# Altium project press.PrjPcb
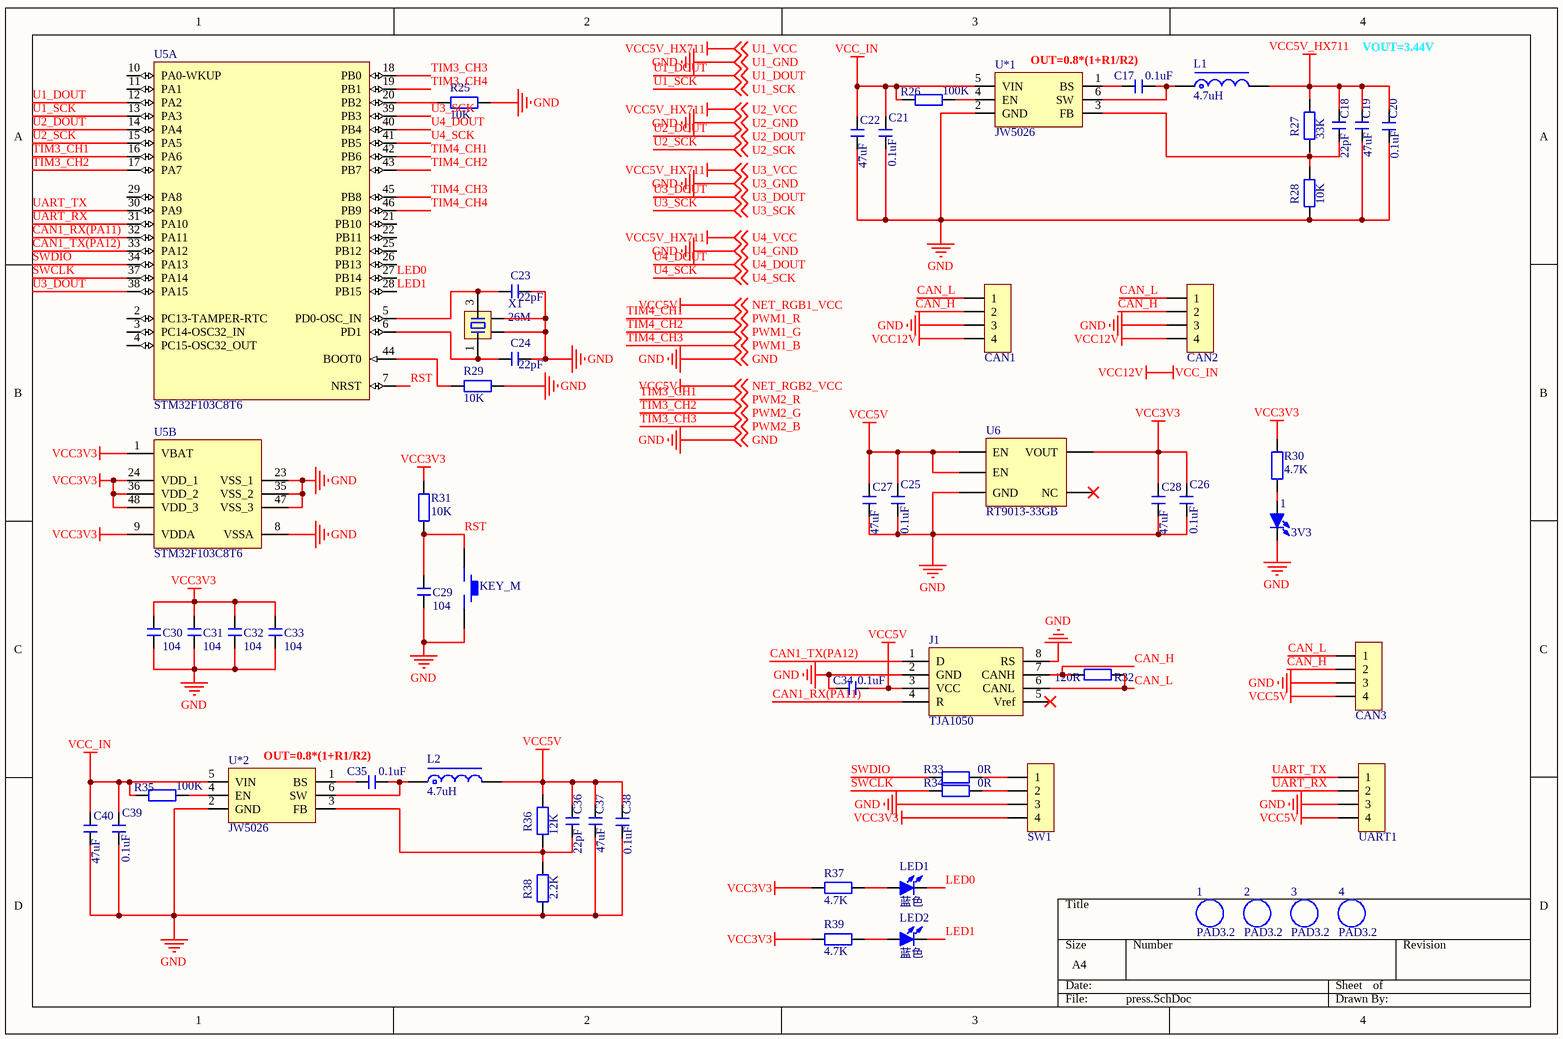
[diagram p0: press.SchDoc]
3 sheets, 178 parts. Net scope: global (net labels, ports and power ports of the same name join across sheets).
Board file: press.PcbDoc
Sheets:
  press.SchDoc
  RGB_LED.SchDoc
  HX711.SchDoc

## Sheet press.SchDoc
size A4

### Parts
(Parts that share a designator on the sheet are numbered #1, #2 ... from top to bottom, then left to right.)
1#1  3V3  [LED 0805R]
1#2  PAD3.2  [PAD3.2]
2  PAD3.2  [PAD3.2]
3  PAD3.2  [PAD3.2]
4  PAD3.2  [PAD3.2]
C17  0.1uF  [C 0603_L]
C18  22pF  [C 0603_L]
C19  47uF  [C 0805_L]
C20  0.1uF  [C 0805_L]
C21  0.1uF  [C 0805_L]
C22  47uF  [C 0805_L]
C23  22pF  [C 0603_L]
C24  22pF  [C 0603_L]
C25  0.1uF  [C 0805_L]
C26  0.1uF  [C 0805_L]
C27  47uF  [C 0805_L]
C28  47uF  [C 0805_L]
C29  104  [C 0603_L]
C30  104  [C 0603_L]
C31  104  [C 0603_L]
C32  104  [C 0603_L]
C33  104  [C 0603_L]
C34  0.1uF  [C 0603_L]
C35  0.1uF  [C 0603_L]
C36  22pF  [C 0603_L]
C37  47uF  [C 0805_L]
C38  0.1uF  [C 0805_L]
C39  0.1uF  [C 0805_L]
C40  47uF  [C 0805_L]
CAN1  HDR-1X4  [MX 1.25-WS-4P]  (value not drawn)
CAN2  HDR-1X4  [MX 1.25-WS-4P]  (value not drawn)
CAN3  HDR-1X4  [MX 1.25-WS-4P]  (value not drawn)
J1  TJA1050  [SOIC-8_150mil]
L1  4.7uH  [CD53]
L2  4.7uH  [CD53]
LED1  蓝色  [LED 0805B]
LED2  蓝色  [LED 0805B]
R25  10K  [R 0603_L]
R26  100K  [R 0603_L]
R27  33K  [R 0603_L]
R28  10K  [R 0603_L]
R29  10K  [R 0603_L]
R30  4.7K  [R 0603_L]
R31  10K  [R 0603_L]
R32  120R  [R 0603_L]
R33  0R  [R 0603_L]
R34  0R  [R 0603_L]
R35  100K  [R 0603_L]
R36  12K  [R 0603_L]
R37  4.7K  [R 0603_L]
R38  2.2K  [R 0603_L]
R39  4.7K  [R 0603_L]
RST1  KEY_M  [SMD-3.2*4.2]
SW1  HDR-1X4  [MX 1.25-WS-4P]  (value not drawn)
U5  STM32F103C8T6  [LQFP48_N]  (parts A,B of 2)
U6  RT9013-33GB  [SOT23-5M]
U*1  JW5026  [SOT-23-6_L2.9-W1.6-P0.95-LS2.8-BL]
U*2  JW5026  [SOT-23-6_L2.9-W1.6-P0.95-LS2.8-BL]
UART1  HDR-1X4  [MX 1.25-WS-4P]  (value not drawn)
X1  26M  [OSC 3225-4P]

### Nets
GND: 1#1.2(K) C19.1 C20.1 C21.1 C22.1 C23.2 C24.2 C25.1 C26.1 C27.1 C28.1 C29.1 C30.1 C31.1 C32.1 C33.1 C34.2 C37.1 C38.1 C39.1 C40.1 CAN1.3 CAN2.3 CAN3.3 J1.2(GND) J1.8(RS) R25.2 R28.1 R29.2 R38.1 RST1.2 SW1.3 U5.8(VSSA) U5.23(VSS_1) U5.35(VSS_2) U5.47(VSS_3) U6.2(GND) U*1.2(GND) U*2.2(GND) UART1.3 X1.2 X1.4 ; off-sheet U1_GND, off-sheet U2_GND, off-sheet U3_GND, off-sheet U4_GND, off-sheet GND  [also labelled U1_GND, U2_GND, U3_GND, U4_GND]
NET_RGB1_VCC: C25.2 C27.2 C34.1 C36.2 C37.2 C38.2 CAN3.4 J1.3(VCC) L2.2 R36.2 U6.1(EN) U6.3(EN) UART1.4 ; off-sheet NET_RGB1_VCC, off-sheet NET_RGB2_VCC  [also labelled NET_RGB2_VCC, VCC5V]
U1_VCC: C18.2 C19.2 C20.2 L1.2 R27.2 ; off-sheet U1_VCC, off-sheet U2_VCC, off-sheet U3_VCC, off-sheet U4_VCC  [also labelled U2_VCC, U3_VCC, U4_VCC, VCC5V_HX711]
VCC3V3: C26.2 C28.2 C30.2 C31.2 C32.2 C33.2 R30.1 R31.2 R37.1 R39.1 SW1.4 U5.1(VBAT) U5.9(VDDA) U5.24(VDD_1) U5.36(VDD_2) U5.48(VDD_3) U6.5(VOUT)
VCC12V: C21.2 C22.2 C39.2 C40.2 CAN1.4 CAN2.4 R26.2 R35.2 U*1.5(VIN) U*2.5(VIN)  [also labelled VCC_IN]
CAN1_RX(PA11): J1.4(R) U5.32(PA11)
CAN1_TX(PA12): J1.1(D) U5.33(PA12)
CAN_H: CAN1.2 CAN2.2 CAN3.2 J1.7(CANH) R32.1
CAN_L: CAN1.1 CAN2.1 CAN3.1 J1.6(CANL) R32.2
LED0: LED1.2(K) U5.27(PB14)
LED1: LED2.2(K) U5.28(PB15)
PWM1_B: U5.45(PB8) ; off-sheet PWM1_B  [also labelled TIM4_CH3]
PWM1_G: U5.43(PB7) ; off-sheet PWM1_G  [also labelled TIM4_CH2]
PWM1_R: U5.42(PB6) ; off-sheet PWM1_R  [also labelled TIM4_CH1]
PWM2_B: U5.18(PB0) ; off-sheet PWM2_B  [also labelled TIM3_CH3]
PWM2_G: U5.17(PA7) ; off-sheet PWM2_G  [also labelled TIM3_CH2]
PWM2_R: U5.16(PA6) ; off-sheet PWM2_R  [also labelled TIM3_CH1]
RST: C29.2 R31.1 RST1.1 U5.7(NRST)
SWCLK: R34.1 U5.37(PA14)
SWDIO: R33.1 U5.34(PA13)
TIM3_CH4: U5.19(PB1)
TIM4_CH4: U5.46(PB9)
U1_DOUT: U5.12(PA2) ; off-sheet U1_DOUT
U1_SCK: U5.13(PA3) ; off-sheet U1_SCK
U2_DOUT: U5.14(PA4) ; off-sheet U2_DOUT
U2_SCK: U5.15(PA5) ; off-sheet U2_SCK
U3_DOUT: U5.38(PA15) ; off-sheet U3_DOUT
U3_SCK: U5.39(PB3) ; off-sheet U3_SCK
U4_DOUT: U5.40(PB4) ; off-sheet U4_DOUT
U4_SCK: U5.41(PB5) ; off-sheet U4_SCK
UART_RX: U5.31(PA10) UART1.2
UART_TX: U5.30(PA9) UART1.1
Net1#1_1: 1#1.1(A) R30.2
NetC17_1: C17.1 U*1.1(BS)
NetC17_2: C17.2 L1.1 U*1.6(SW)
NetC18_1: C18.1 R27.1 R28.2 U*1.3(FB)
NetC23_1: C23.1 U5.5(PD0-OSC_IN) X1.3
NetC24_1: C24.1 U5.6(PD1) X1.1
NetC35_1: C35.1 U*2.1(BS)
NetC35_2: C35.2 L2.1 U*2.6(SW)
NetC36_1: C36.1 R36.1 R38.2 U*2.3(FB)
NetLED1_1: LED1.1(A) R37.2
NetLED2_1: LED2.1(A) R39.2
NetR25_1: R25.1 U5.20(PB2)
NetR26_1: R26.1 U*1.4(EN)
NetR29_1: R29.1 U5.44(BOOT0)
NetR33_2: R33.2 SW1.1
NetR34_2: R34.2 SW1.2
NetR35_1: R35.1 U*2.4(EN)

Not connected (* = marked no-connect by the designer): J1 5(Vref)*; U5 2(PC13-TAMPER-RTC) 3(PC14-OSC32_IN) 4(PC15-OSC32_OUT) 10(PA0-WKUP) 11(PA1) 21(PB10) 22(PB11) 25(PB12) 26(PB13) 29(PA8); U6 4(NC)*

### Notes on the sheet
- OUT=0.8*(1+R1/R2)
- VOUT=3.44V

### Library data of the parts
1#1 LED1 LED2 = LED-SMD: 贴片LED
C17-C40 = C: 贴片电容
CAN1-CAN3 SW1 UART1 = Header 4: 4P接插件
J1 = TJA1050: CAN芯片
L1 L2 = L-SMD: CD系列贴片线绕功率电感
R25-R39 = R: 贴片电阻
U5 = STM32F103C8T6: STM32 ARM-based 32-bit MCU Performance Line with 64 kB Flash, 20 kB Internal RAM, -40 to +85癈 Temperature, 48-Pin LQFP, Tray; DatasheetVersion: rev13.0, Apr-2011; PackageVersion: rev13, Apr-2011; PackageReference: LQFP48; PackageDescription: 48-Pin Low-Profile Quad Flat Pack, 7 x 7 mm Body, 0.5 mm Pitch (LQFP48); ComponentLink1Description: Manufacturer URL; ComponentLink1URL: http://www.st.com/; ComponentLink2Description: STM32F103 Datasheet; ComponentLink2URL: http://www.st.com/internet/com/TECHNICAL_RESOURCES/TECHNICAL_LITERATURE/DATASHEET/CD00161566.pdf; ComponentLink3Description: STM32 Family Web Page; ComponentLink3URL: www.st.com/stm32; 联系售后: https://shop463601444.taobao.com
U*1 U*2 = JW5026 : BUCK、MAX40V
X1 = XTAL-4P: 4脚无源晶振

## Sheet RGB_LED.SchDoc
size A4
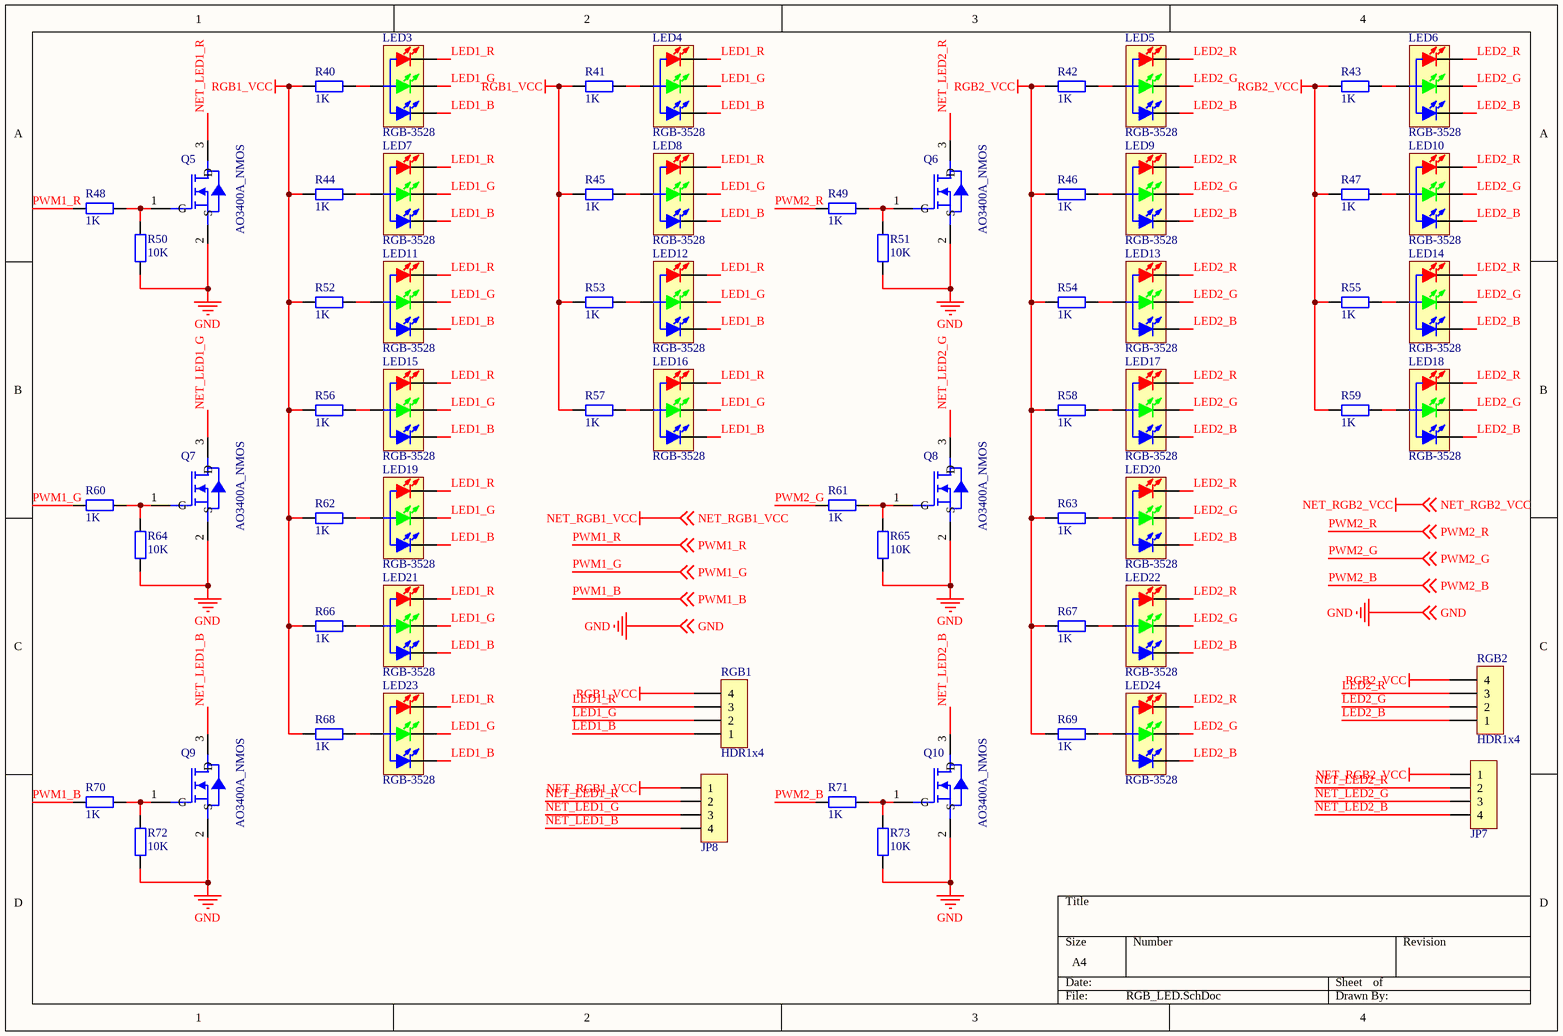
[diagram p1: RGB_LED.SchDoc]

### Parts
JP7  HDR-1X4  [MX 1.25-WS-4P]  (value not drawn)
JP8  HDR-1X4  [MX 1.25-WS-4P]  (value not drawn)
LED3  RGB-3528  [LED 3528-4Pin]
LED4  RGB-3528  [LED 3528-4Pin]
LED5  RGB-3528  [LED 3528-4Pin]
LED6  RGB-3528  [LED 3528-4Pin]
LED7  RGB-3528  [LED 3528-4Pin]
LED8  RGB-3528  [LED 3528-4Pin]
LED9  RGB-3528  [LED 3528-4Pin]
LED10  RGB-3528  [LED 3528-4Pin]
LED11  RGB-3528  [LED 3528-4Pin]
LED12  RGB-3528  [LED 3528-4Pin]
LED13  RGB-3528  [LED 3528-4Pin]
LED14  RGB-3528  [LED 3528-4Pin]
LED15  RGB-3528  [LED 3528-4Pin]
LED16  RGB-3528  [LED 3528-4Pin]
LED17  RGB-3528  [LED 3528-4Pin]
LED18  RGB-3528  [LED 3528-4Pin]
LED19  RGB-3528  [LED 3528-4Pin]
LED20  RGB-3528  [LED 3528-4Pin]
LED21  RGB-3528  [LED 3528-4Pin]
LED22  RGB-3528  [LED 3528-4Pin]
LED23  RGB-3528  [LED 3528-4Pin]
LED24  RGB-3528  [LED 3528-4Pin]
Q5  AO3400A_NMOS  [SOT-23-3_L2.9-W1.3-P1.90-LS2.4-BR]
Q6  AO3400A_NMOS  [SOT-23-3_L2.9-W1.3-P1.90-LS2.4-BR]
Q7  AO3400A_NMOS  [SOT-23-3_L2.9-W1.3-P1.90-LS2.4-BR]
Q8  AO3400A_NMOS  [SOT-23-3_L2.9-W1.3-P1.90-LS2.4-BR]
Q9  AO3400A_NMOS  [SOT-23-3_L2.9-W1.3-P1.90-LS2.4-BR]
Q10  AO3400A_NMOS  [SOT-23-3_L2.9-W1.3-P1.90-LS2.4-BR]
R40  1K  [R 0603_L]
R41  1K  [R 0603_L]
R42  1K  [R 0603_L]
R43  1K  [R 0603_L]
R44  1K  [R 0603_L]
R45  1K  [R 0603_L]
R46  1K  [R 0603_L]
R47  1K  [R 0603_L]
R48  1K  [R 0603_L]
R49  1K  [R 0603_L]
R50  10K  [R 0603_L]
R51  10K  [R 0603_L]
R52  1K  [R 0603_L]
R53  1K  [R 0603_L]
R54  1K  [R 0603_L]
R55  1K  [R 0603_L]
R56  1K  [R 0603_L]
R57  1K  [R 0603_L]
R58  1K  [R 0603_L]
R59  1K  [R 0603_L]
R60  1K  [R 0603_L]
R61  1K  [R 0603_L]
R62  1K  [R 0603_L]
R63  1K  [R 0603_L]
R64  10K  [R 0603_L]
R65  10K  [R 0603_L]
R66  1K  [R 0603_L]
R67  1K  [R 0603_L]
R68  1K  [R 0603_L]
R69  1K  [R 0603_L]
R70  1K  [R 0603_L]
R71  1K  [R 0603_L]
R72  10K  [R 0603_L]
R73  10K  [R 0603_L]
RGB1  HDR1x4  [1.25-4P-焊盘]
RGB2  HDR1x4  [1.25-4P-焊盘]

### Nets
GND: Q5.2(S) Q6.2(S) Q7.2(S) Q8.2(S) Q9.2(S) Q10.2(S) R50.1 R51.1 R64.1 R65.1 R72.1 R73.1 ; off-sheet GND
NET_RGB1_VCC: JP7.1 JP8.1 ; off-sheet NET_RGB1_VCC, off-sheet NET_RGB2_VCC  [also labelled NET_RGB2_VCC]
RGB1_VCC: R40.1 R41.1 R44.1 R45.1 R52.1 R53.1 R56.1 R57.1 R62.1 R66.1 R68.1 RGB1.4
RGB2_VCC: R42.1 R43.1 R46.1 R47.1 R54.1 R55.1 R58.1 R59.1 R63.1 R67.1 R69.1 RGB2.4
LED1_B: LED3.3(BULE_K) LED4.3(BULE_K) LED7.3(BULE_K) LED8.3(BULE_K) LED11.3(BULE_K) LED12.3(BULE_K) LED15.3(BULE_K) LED16.3(BULE_K) LED19.3(BULE_K) LED21.3(BULE_K) LED23.3(BULE_K) RGB1.1
LED1_G: LED3.2(GREEN_K) LED4.2(GREEN_K) LED7.2(GREEN_K) LED8.2(GREEN_K) LED11.2(GREEN_K) LED12.2(GREEN_K) LED15.2(GREEN_K) LED16.2(GREEN_K) LED19.2(GREEN_K) LED21.2(GREEN_K) LED23.2(GREEN_K) RGB1.2
LED1_R: LED3.1(RED_K) LED4.1(RED_K) LED7.1(RED_K) LED8.1(RED_K) LED11.1(RED_K) LED12.1(RED_K) LED15.1(RED_K) LED16.1(RED_K) LED19.1(RED_K) LED21.1(RED_K) LED23.1(RED_K) RGB1.3
LED2_B: LED5.3(BULE_K) LED6.3(BULE_K) LED9.3(BULE_K) LED10.3(BULE_K) LED13.3(BULE_K) LED14.3(BULE_K) LED17.3(BULE_K) LED18.3(BULE_K) LED20.3(BULE_K) LED22.3(BULE_K) LED24.3(BULE_K) RGB2.1
LED2_G: LED5.2(GREEN_K) LED6.2(GREEN_K) LED9.2(GREEN_K) LED10.2(GREEN_K) LED13.2(GREEN_K) LED14.2(GREEN_K) LED17.2(GREEN_K) LED18.2(GREEN_K) LED20.2(GREEN_K) LED22.2(GREEN_K) LED24.2(GREEN_K) RGB2.2
LED2_R: LED5.1(RED_K) LED6.1(RED_K) LED9.1(RED_K) LED10.1(RED_K) LED13.1(RED_K) LED14.1(RED_K) LED17.1(RED_K) LED18.1(RED_K) LED20.1(RED_K) LED22.1(RED_K) LED24.1(RED_K) RGB2.3
NET_LED1_B: JP8.4 Q9.3(D)
NET_LED1_G: JP8.3 Q7.3(D)
NET_LED1_R: JP8.2 Q5.3(D)
NET_LED2_B: JP7.4 Q10.3(D)
NET_LED2_G: JP7.3 Q8.3(D)
NET_LED2_R: JP7.2 Q6.3(D)
PWM1_B: R70.2 ; off-sheet PWM1_B
PWM1_G: R60.2 ; off-sheet PWM1_G
PWM1_R: R48.2 ; off-sheet PWM1_R
PWM2_B: R71.2 ; off-sheet PWM2_B
PWM2_G: R61.2 ; off-sheet PWM2_G
PWM2_R: R49.2 ; off-sheet PWM2_R
NetLED3_4: LED3.4(A) R40.2
NetLED4_4: LED4.4(A) R41.2
NetLED5_4: LED5.4(A) R42.2
NetLED6_4: LED6.4(A) R43.2
NetLED7_4: LED7.4(A) R44.2
NetLED8_4: LED8.4(A) R45.2
NetLED9_4: LED9.4(A) R46.2
NetLED10_4: LED10.4(A) R47.2
NetLED11_4: LED11.4(A) R52.2
NetLED12_4: LED12.4(A) R53.2
NetLED13_4: LED13.4(A) R54.2
NetLED14_4: LED14.4(A) R55.2
NetLED15_4: LED15.4(A) R56.2
NetLED16_4: LED16.4(A) R57.2
NetLED17_4: LED17.4(A) R58.2
NetLED18_4: LED18.4(A) R59.2
NetLED19_4: LED19.4(A) R62.2
NetLED20_4: LED20.4(A) R63.2
NetLED21_4: LED21.4(A) R66.2
NetLED22_4: LED22.4(A) R67.2
NetLED23_4: LED23.4(A) R68.2
NetLED24_4: LED24.4(A) R69.2
NetQ5_1: Q5.1(G) R48.1 R50.2
NetQ6_1: Q6.1(G) R49.1 R51.2
NetQ7_1: Q7.1(G) R60.1 R64.2
NetQ8_1: Q8.1(G) R61.1 R65.2
NetQ9_1: Q9.1(G) R70.1 R72.2
NetQ10_1: Q10.1(G) R71.1 R73.2

### Library data of the parts
JP7 JP8 = Header 4: 4P接插件
LED3-LED24 = LED-RGB 3528: 3528三基色LED
R40-R73 = R: 贴片电阻
RGB1 RGB2 = HDR1x4: Connector

## Sheet HX711.SchDoc
size A4
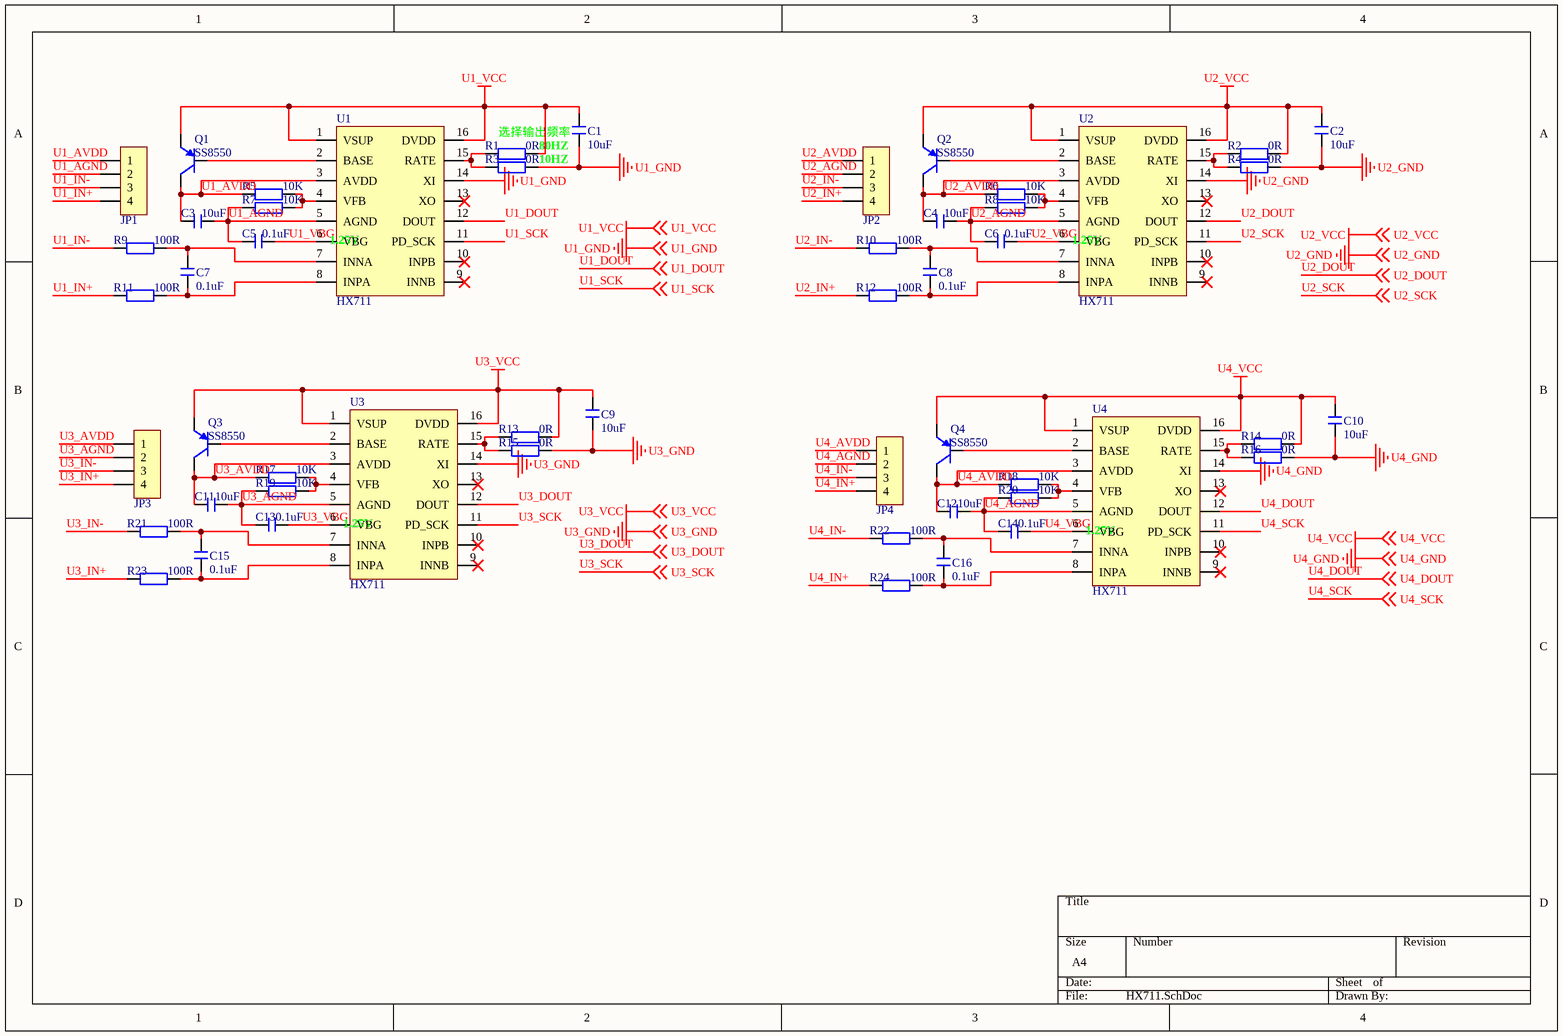
[diagram p2: HX711.SchDoc]

### Parts
C1  10uF  [C 0603_L]
C2  10uF  [C 0603_L]
C3  10uF  [C 0603_L]
C4  10uF  [C 0603_L]
C5  0.1uF  [C 0603_L]
C6  0.1uF  [C 0603_L]
C7  0.1uF  [C 0603_L]
C8  0.1uF  [C 0603_L]
C9  10uF  [C 0603_L]
C10  10uF  [C 0603_L]
C11  10uF  [C 0603_L]
C12  10uF  [C 0603_L]
C13  0.1uF  [C 0603_L]
C14  0.1uF  [C 0603_L]
C15  0.1uF  [C 0603_L]
C16  0.1uF  [C 0603_L]
JP1  HDR-1X4  [MX 1.25-WS-4P]  (value not drawn)
JP2  HDR-1X4  [MX 1.25-WS-4P]  (value not drawn)
JP3  HDR-1X4  [MX 1.25-WS-4P]  (value not drawn)
JP4  HDR-1X4  [MX 1.25-WS-4P]  (value not drawn)
Q1  SS8550  [SOT23-3N]
Q2  SS8550  [SOT23-3N]
Q3  SS8550  [SOT23-3N]
Q4  SS8550  [SOT23-3N]
R1  0R  [R 0603_L]
R2  0R  [R 0603_L]
R3  0R  [R 0603_L]
R4  0R  [R 0603_L]
R5  10K  [R 0603_L]
R6  10K  [R 0603_L]
R7  10K  [R 0603_L]
R8  10K  [R 0603_L]
R9  100R  [R 0603_L]
R10  100R  [R 0603_L]
R11  100R  [R 0603_L]
R12  100R  [R 0603_L]
R13  0R  [R 0603_L]
R14  0R  [R 0603_L]
R15  0R  [R 0603_L]
R16  0R  [R 0603_L]
R17  10K  [R 0603_L]
R18  10K  [R 0603_L]
R19  10K  [R 0603_L]
R20  10K  [R 0603_L]
R21  100R  [R 0603_L]
R22  100R  [R 0603_L]
R23  100R  [R 0603_L]
R24  100R  [R 0603_L]
U1  HX711  [SOP16_L]
U2  HX711  [SOP16_L]
U3  HX711  [SOP16_L]
U4  HX711  [SOP16_L]

### Nets
U1_GND: C1.2 C2.2 C9.2 C10.2 R3.2 R4.2 R15.2 R16.2 U1.14(XI) U2.14(XI) U3.14(XI) U4.14(XI) ; off-sheet U1_GND, off-sheet U2_GND, off-sheet U3_GND, off-sheet U4_GND  [also labelled U2_GND, U3_GND, U4_GND]  [project net GND]
U1_VCC: C1.1 C2.1 C9.1 C10.1 Q1.2(E) Q2.2(E) Q3.2(E) Q4.2(E) R1.2 R2.2 R13.2 R14.2 U1.1(VSUP) U1.16(DVDD) U2.1(VSUP) U2.16(DVDD) U3.1(VSUP) U3.16(DVDD) U4.1(VSUP) U4.16(DVDD) ; off-sheet U1_VCC, off-sheet U2_VCC, off-sheet U3_VCC, off-sheet U4_VCC  [also labelled U2_VCC, U3_VCC, U4_VCC]
U1_AGND: C3.1 C5.2 JP1.2 R7.1 U1.5(AGND)
U1_AVDD: C3.2 JP1.1 Q1.3(C) R5.1 U1.3(AVDD)
U1_DOUT: U1.12(DOUT) ; off-sheet U1_DOUT
U1_IN+: JP1.4 R11.1
U1_IN-: JP1.3 R9.1
U1_SCK: U1.11(PD_SCK) ; off-sheet U1_SCK
U1_VBG: C5.1 U1.6(VBG)
U2_AGND: C4.1 C6.2 JP2.2 R8.1 U2.5(AGND)
U2_AVDD: C4.2 JP2.1 Q2.3(C) R6.1 U2.3(AVDD)
U2_DOUT: U2.12(DOUT) ; off-sheet U2_DOUT
U2_IN+: JP2.4 R12.1
U2_IN-: JP2.3 R10.1
U2_SCK: U2.11(PD_SCK) ; off-sheet U2_SCK
U2_VBG: C6.1 U2.6(VBG)
U3_AGND: C11.1 C13.2 JP3.2 R19.1 U3.5(AGND)
U3_AVDD: C11.2 JP3.1 Q3.3(C) R17.1 U3.3(AVDD)
U3_DOUT: U3.12(DOUT) ; off-sheet U3_DOUT
U3_IN+: JP3.4 R23.1
U3_IN-: JP3.3 R21.1
U3_SCK: U3.11(PD_SCK) ; off-sheet U3_SCK
U3_VBG: C13.1 U3.6(VBG)
U4_AGND: C12.1 C14.2 JP4.2 R20.1 U4.5(AGND)
U4_AVDD: C12.2 JP4.1 Q4.3(C) R18.1 U4.3(AVDD)
U4_DOUT: U4.12(DOUT) ; off-sheet U4_DOUT
U4_IN+: JP4.4 R24.1
U4_IN-: JP4.3 R22.1
U4_SCK: U4.11(PD_SCK) ; off-sheet U4_SCK
U4_VBG: C14.1 U4.6(VBG)
NetC7_1: C7.1 R9.2 U1.7(INNA)
NetC7_2: C7.2 R11.2 U1.8(INPA)
NetC8_1: C8.1 R10.2 U2.7(INNA)
NetC8_2: C8.2 R12.2 U2.8(INPA)
NetC15_1: C15.1 R21.2 U3.7(INNA)
NetC15_2: C15.2 R23.2 U3.8(INPA)
NetC16_1: C16.1 R22.2 U4.7(INNA)
NetC16_2: C16.2 R24.2 U4.8(INPA)
NetQ1_1: Q1.1(B) U1.2(BASE)
NetQ2_1: Q2.1(B) U2.2(BASE)
NetQ3_1: Q3.1(B) U3.2(BASE)
NetQ4_1: Q4.1(B) U4.2(BASE)
NetR1_1: R1.1 R3.1 U1.15(RATE)
NetR2_1: R2.1 R4.1 U2.15(RATE)
NetR5_2: R5.2 R7.2 U1.4(VFB)
NetR6_2: R6.2 R8.2 U2.4(VFB)
NetR13_1: R13.1 R15.1 U3.15(RATE)
NetR14_1: R14.1 R16.1 U4.15(RATE)
NetR17_2: R17.2 R19.2 U3.4(VFB)
NetR18_2: R18.2 R20.2 U4.4(VFB)

Not connected (* = marked no-connect by the designer): U1 9(INNB)* 10(INPB)* 13(XO)*; U2 9(INNB)* 10(INPB)* 13(XO)*; U3 9(INNB)* 10(INPB)* 13(XO)*; U4 9(INNB)* 10(INPB)* 13(XO)*

### Notes on the sheet
- (near R1) 选择输出频率
- 80HZ
- 10HZ
- (near U1) 1.25V
- (near U2) 1.25V
- (near U3) 1.25V
- (near U4) 1.25V

### Library data of the parts
C1-C16 = C: 贴片电容
JP1-JP4 = Header 4: 4P接插件
Q1-Q4 = 8550-SMD: 高频放大-PNP型
R1-R24 = R: 贴片电阻

## Nets that join several sheets
GND: press (42 pins), RGB_LED (12 pins), HX711 (12 pins)
NET_RGB1_VCC: press (13 pins), RGB_LED (JP7.1 JP8.1)
U1_VCC: press (5 pins), HX711 (20 pins)
PWM1_B: press (U5.45), RGB_LED (R70.2)
PWM1_G: press (U5.43), RGB_LED (R60.2)
PWM1_R: press (U5.42), RGB_LED (R48.2)
PWM2_B: press (U5.18), RGB_LED (R71.2)
PWM2_G: press (U5.17), RGB_LED (R61.2)
PWM2_R: press (U5.16), RGB_LED (R49.2)
U1_DOUT: press (U5.12), HX711 (U1.12)
U1_SCK: press (U5.13), HX711 (U1.11)
U2_DOUT: press (U5.14), HX711 (U2.12)
U2_SCK: press (U5.15), HX711 (U2.11)
U3_DOUT: press (U5.38), HX711 (U3.12)
U3_SCK: press (U5.39), HX711 (U3.11)
U4_DOUT: press (U5.40), HX711 (U4.12)
U4_SCK: press (U5.41), HX711 (U4.11)